# Altium schematic sheet ESP32_S2_solo.SchDoc
size A4; Engineer: Naif Aljohani; DocumentNumber: 3; Revision: v1.0; SheetNumber: 3; SheetTotal: 7; SPICEModelCacheSFRKXKUM: <root> / <DocumentId>SFRKXKUM</DocumentId> / </root>
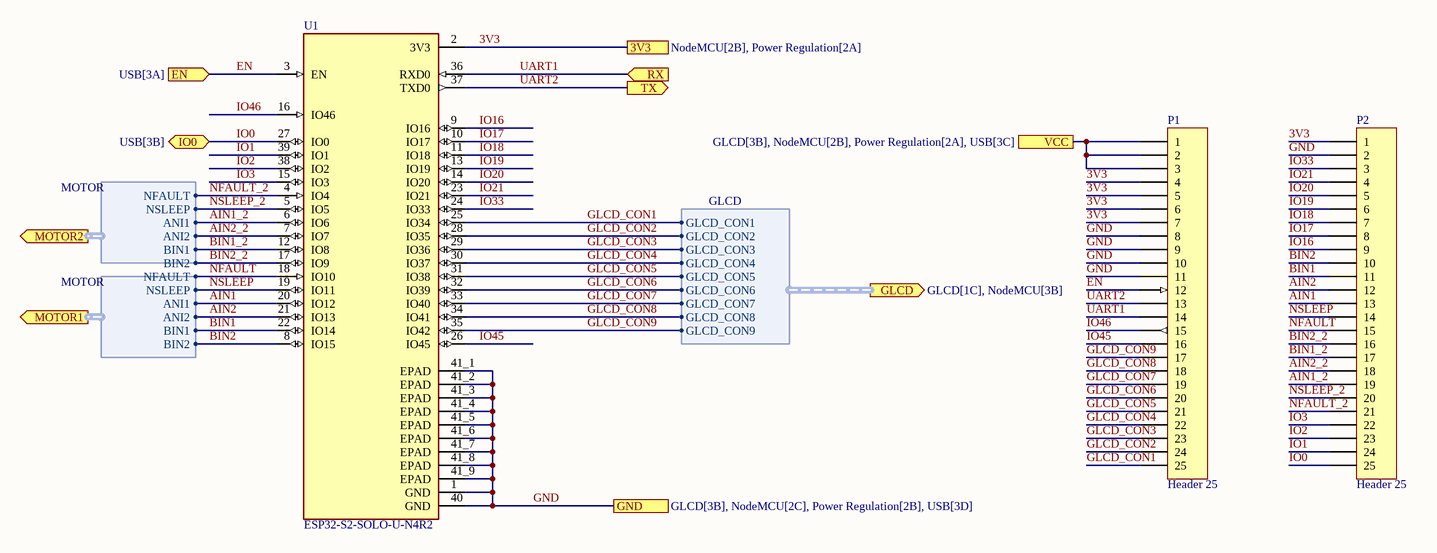
[diagram p0: ESP32_S2_solo.SchDoc]

## Parts
P1  Header 25  [HDR1X25]
P2  Header 25  [HDR1X25]
U1  ESP32-S2-SOLO-U-N4R2  [XCVR_ESP32-S2-SOLO-U-N4R2]

## Ports
3V3 (see NodeMCU[2B], Power Regulation[2A]), EN (in, see USB[3A]), GLCD (out, harness GLCD, see GLCD[1C], NodeMCU[3B]), GND (see GLCD[3B], NodeMCU[2C], Power Regulation[2B], USB[3D]), IO0 (bidir, see USB[3B]), MOTOR1 (out, harness MOTOR), MOTOR2 (out, harness MOTOR), RX (in), TX (out), VCC (see GLCD[3B], NodeMCU[2B], Power Regulation[2A], USB[3C])

## Harnesses
GLCD: GLCD_CON1, GLCD_CON2, GLCD_CON3, GLCD_CON4, GLCD_CON5, GLCD_CON6, GLCD_CON7, GLCD_CON8, GLCD_CON9
MOTOR: NFAULT, NSLEEP, ANI1, ANI2, BIN1, BIN2

## Nets
3V3: P1.4 P1.5 P1.6 P1.7 P2.1 U1.2(3V3) ; port 3V3
AIN1: P2.13 U1.20(IO12) ; port MOTOR1.ANI1
AIN1_2: P2.19 U1.6(IO6) ; port MOTOR2.ANI1
AIN2: P2.12 U1.21(IO13) ; port MOTOR1.ANI2
AIN2_2: P2.18 U1.7(IO7) ; port MOTOR2.ANI2
BIN1: P2.11 U1.22(IO14) ; port MOTOR1.BIN1
BIN1_2: P2.17 U1.12(IO8) ; port MOTOR2.BIN1
BIN2: P2.10 U1.8(IO15) ; port MOTOR1.BIN2
BIN2_2: P2.16 U1.17(IO9) ; port MOTOR2.BIN2
EN: P1.12 U1.3(EN) ; port EN
GLCD_CON1: P1.25 U1.25(IO34) ; port GLCD.GLCD_CON1
GLCD_CON2: P1.24 U1.28(IO35) ; port GLCD.GLCD_CON2
GLCD_CON3: P1.23 U1.29(IO36) ; port GLCD.GLCD_CON3
GLCD_CON4: P1.22 U1.30(IO37) ; port GLCD.GLCD_CON4
GLCD_CON5: P1.21 U1.31(IO38) ; port GLCD.GLCD_CON5
GLCD_CON6: P1.20 U1.32(IO39) ; port GLCD.GLCD_CON6
GLCD_CON7: P1.19 U1.33(IO40) ; port GLCD.GLCD_CON7
GLCD_CON8: P1.18 U1.34(IO41) ; port GLCD.GLCD_CON8
GLCD_CON9: P1.17 U1.35(IO42) ; port GLCD.GLCD_CON9
GND: P1.8 P1.9 P1.10 P1.11 P2.2 U1.1(GND) U1.40(GND) U1.41_1(EPAD) U1.41_2(EPAD) U1.41_3(EPAD) U1.41_4(EPAD) U1.41_5(EPAD) U1.41_6(EPAD) U1.41_7(EPAD) U1.41_8(EPAD) U1.41_9(EPAD) ; port GND
IO0: P2.25 U1.27(IO0) ; port IO0
IO1: P2.24 U1.39(IO1)
IO2: P2.23 U1.38(IO2)
IO3: P2.22 U1.15(IO3)
IO16: P2.9 U1.9(IO16)
IO17: P2.8 U1.10(IO17)
IO18: P2.7 U1.11(IO18)
IO19: P2.6 U1.13(IO19)
IO20: P2.5 U1.14(IO20)
IO21: P2.4 U1.23(IO21)
IO33: P2.3 U1.24(IO33)
IO45: P1.16 U1.26(IO45)
IO46: P1.15 U1.16(IO46)
NFAULT: P2.15 U1.18(IO10) ; port MOTOR1.NFAULT
NFAULT_2: P2.21 U1.4(IO4) ; port MOTOR2.NFAULT
NSLEEP: P2.14 U1.19(IO11) ; port MOTOR1.NSLEEP
NSLEEP_2: P2.20 U1.5(IO5) ; port MOTOR2.NSLEEP
UART1: P1.14 U1.36(RXD0) ; port RX
UART2: P1.13 U1.37(TXD0) ; port TX
VCC: P1.1 P1.2 P1.3 ; port VCC

## Library data of the parts
P1 P2 = Header 25: Header, 25-Pin; LatestRevisionDate: 17-Jul-2002; LatestRevisionNote: Re-released for DXP Platform.; Publisher: Altium Limited
U1 = ESP32-S2-SOLO-U-N4R2: MF: {'manufacturer': u'Espressif Systems'}; Package: None; Price: None; MP: ESP32-S2-SOLO-U-N4R2; Availability: Unavailable; Value: *